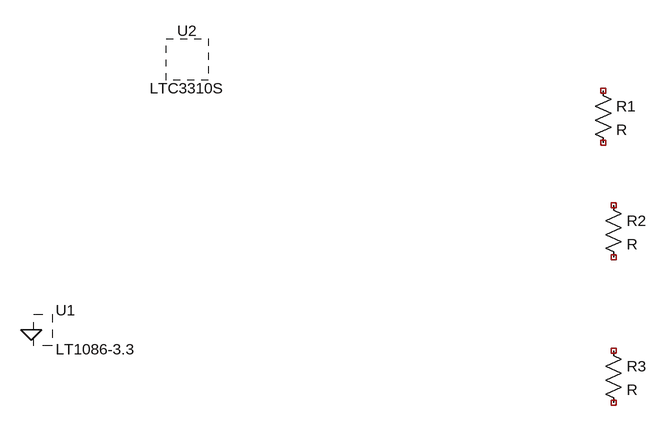
[diagram p0: schematic Draft1.asc]
Draft1.asc, the LTspice schematic file:
Version 4
SHEET 1 880 680
FLAG -432 496 0
SYMBOL res 432 112 R0
SYMATTR InstName R1
SYMBOL res 448 288 R0
SYMATTR InstName R2
SYMBOL res 448 512 R0
SYMATTR InstName R3
SYMBOL PowerProducts\\LT1086-3.3 16 528 R0
SYMATTR InstName U1
SYMBOL PowerProducts\\LTC3310S -192 80 R0
SYMATTR InstName U2

The netlist it stands for:
* Draft1.asc
R1 NC_01 NC_02 R
R2 NC_03 NC_04 R
R3 NC_05 NC_06 R
* U1: LT1086-3.3 (symbol PowerProducts\LT1086-3.3 not available, pin order unknown); nets seen at it: 0
* U2: LTC3310S (symbol PowerProducts\LTC3310S not available, pin order unknown); nets seen at it: 
.backanno
.end